# Altium project [G02]LinearFaderBoard.PrjPcb
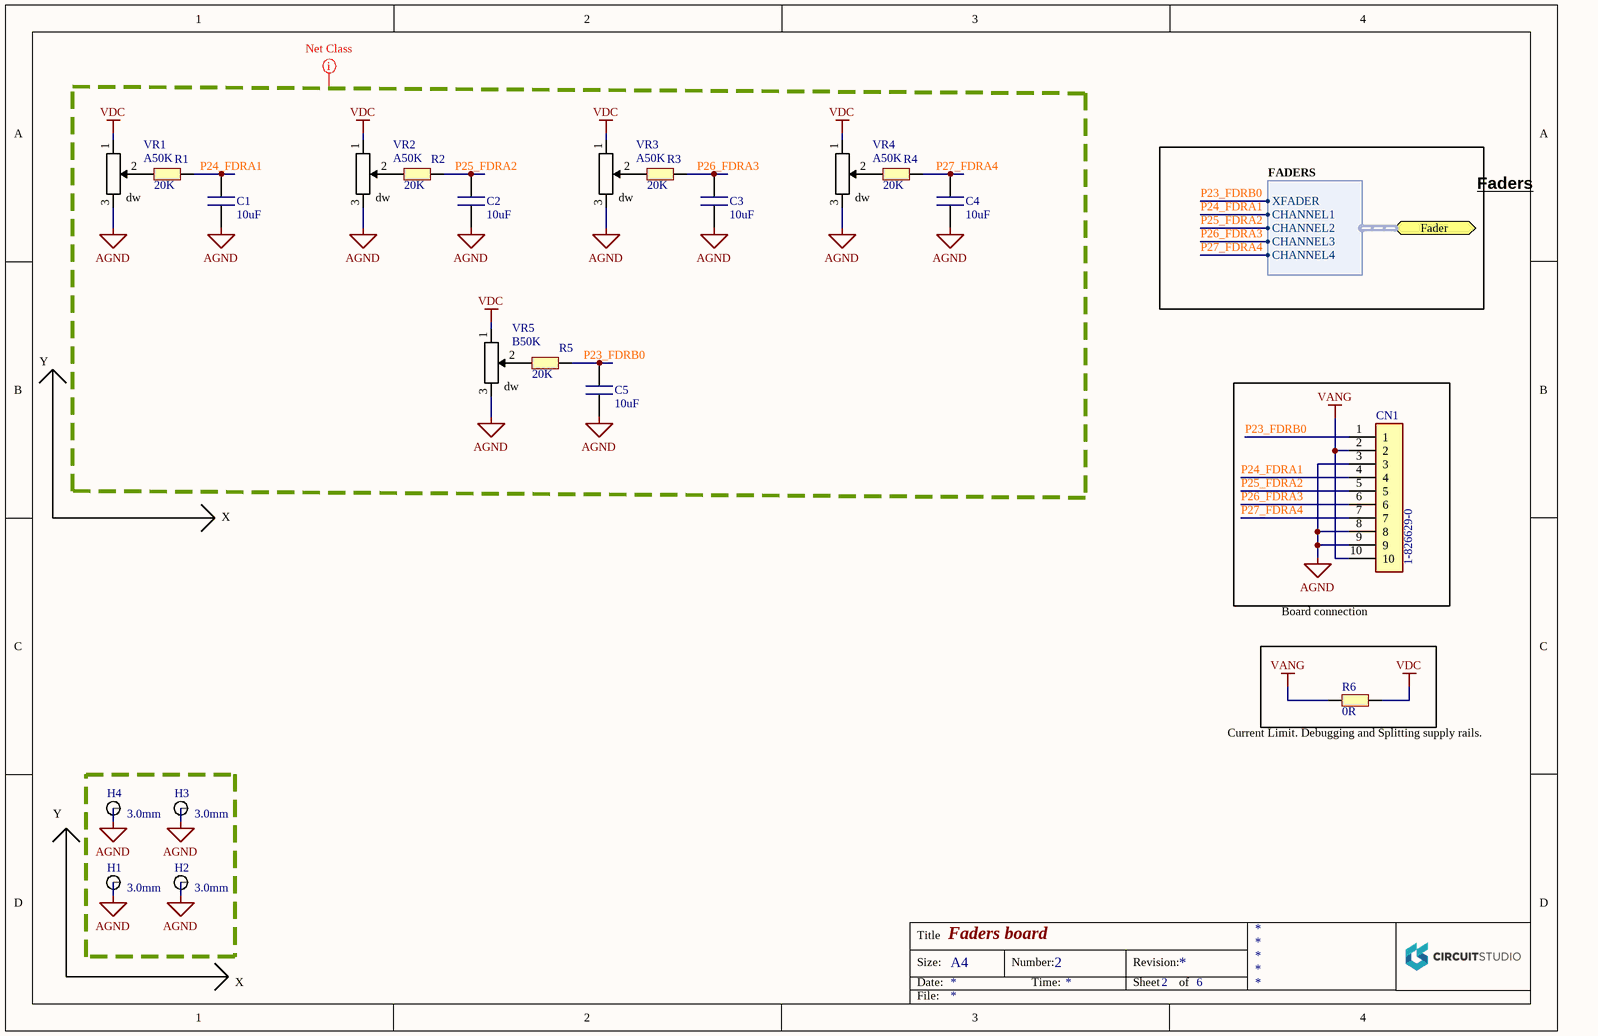
[diagram p0: LinearFaders.SchDoc]
Company: Adrengineer; DesignedByURL: Adrian; PartNumber: 0001; Project: 1
1 sheet, 21 parts. Net scope: global (net labels, ports and power ports of the same name join across sheets).

## Sheet LinearFaders.SchDoc: Faders board
size A4; CheckedBy: Manuel Raya; CompanyName: Universidad De Huelva; DrawnBy: Adrian Moreno; DocumentNumber: 2; SheetNumber: 2; SheetTotal: 6; PageSetup: Record=PageOptions|CenterHorizontal=True|CenterVertical=True|PrintScale=0.97|XCorrection=1.00|YCorrection=1.00|PrintKind=1|BorderSize=5000000|LeftOffset=0|BottomOffset=0|Orientation=2|PaperLength=1000|PaperWidth=1000|Scale=100|PaperSource=285|PrintQuality=-3|MediaType=1|DitherType=10|PrintScaleMode=1|PaperKind=A4|PaperIndex=9

### Parts
C1  10uF  [CAP 0603 10uF]
C2  10uF  [CAP 0603 10uF]
C3  10uF  [CAP 0603 10uF]
C4  10uF  [CAP 0603 10uF]
C5  10uF  [CAP 0603 10uF]
CN1  1-826629-0  [TE_1-826629-0]
H1  3.0mm  [HOLE-3.0MM+PAD]
H2  3.0mm  [HOLE-3.0MM+PAD]
H3  3.0mm  [HOLE-3.0MM+PAD]
H4  3.0mm  [HOLE-3.0MM+PAD]
R1  20K  [RES 0603 20K]
R2  20K  [RES 0603 20K]
R3  20K  [RES 0603 20K]
R4  20K  [RES 0603 20K]
R5  20K  [RES 0603 20K]
R6  0R  [RES 0603]
VR1  A50K  [PTA4543]
VR2  A50K  [PTA4543]
VR3  A50K  [PTA4543]
VR4  A50K  [PTA4543]
VR5  B50K  [PTA4543]

### Ports
Fader (harness FADERS)

### Harnesses
FADERS: XFADER, CHANNEL1, CHANNEL2, CHANNEL3, CHANNEL4

### Nets
AGND: C1.1 C2.1 C3.1 C4.1 C5.1 CN1.3 CN1.8 CN1.9 H1.1 H2.1 H3.1 H4.1 VR1.3 VR2.3 VR3.3 VR4.3 VR5.3
VANG: CN1.2 CN1.10 R6.1
VDC: R6.2 VR1.1 VR2.1 VR3.1 VR4.1 VR5.1
P23_FDRB0: C5.2 CN1.1 R5.2 ; port Fader.XFADER
P24_FDRA1: C1.2 CN1.4 R1.2 ; port Fader.CHANNEL1
P25_FDRA2: C2.2 CN1.5 R2.2 ; port Fader.CHANNEL2
P26_FDRA3: C3.2 CN1.6 R3.2 ; port Fader.CHANNEL3
P27_FDRA4: C4.2 CN1.7 R4.2 ; port Fader.CHANNEL4
NetR1_1: R1.1 VR1.2
NetR2_1: R2.1 VR2.2
NetR3_1: R3.1 VR3.2
NetR4_1: R4.1 VR4.2
NetR5_1: R5.1 VR5.2

### Layout directives
net class FdrGrp: (no net found under the mark)

### Notes on the sheet
- Faders
- Y
- X
- (near CN1) Board connection
- (near R6) Current Limit. Debugging and Splitting supply rails.
- Title
- Size:
- Date:
- A4
- Number:
- Time:
- Revision:
- Sheet
- of
- File:
- (in symbol PTA4543-2015CPA503) dw /
- (in symbol PTA4543-2015CPB503) dw /

### Library data of the parts
C1-C5 = CAP 0603 10uF: 16V 10uF X5R ±20% 0603 MLCC; MP: CS1608X5R106M160NRB; MN: Samwha Capacitor; Value: 10uF; Footprint: 0603; Tolerance: 20%; Dielectric: X5R; LCSC: C2909630
CN1 = 1-826629-0: Conn Unshrouded Header HDR 10 POS 2.54mm Solder ST Thru-Hole Carton; MF: TE Connectivity; Value: *; Availability: Unavailable; Price: None; Package: None; MP: 1-826629-0; SnapEDA_Link: https://www.snapeda.com/parts/1-826629-0/TE%20Connectivity%20AMP%20Connectors/view-part/2877207/?ref=snap
H1-H4 = 3.0MM HOLE+6mmPAD: Value: 3.0mm
R1-R5 = RES0603_20K: 0603 Standard 20K Resistor, 1%, 100mW, ±200ppm/℃,Thick Film; UA P/N: 13-0004; MP: ETCR0603F20K0K9; MN: Resistor.Today; Value: 20K; Footprint: 0603; Type: THICK FILM; LCSC: C365403; Price: *
R6 = RES0603_0R: 0603 Standard 0R Resistor, 1%, 100mW, ±200ppm/℃,Thick Film; UA P/N: 13-0004; MP: AF0603FR-070RL; MN: YAGEO; Value: 0R; Footprint: 0603; Type: THICK FILM; LCSC: C192909; Price: *
VR1-VR4 = PTA4543-2015CPA503: Slide Potentiometers PANEL CONTROL - SLIDE CARBON; MN: Bourns; MP: PTA4543-2015CPA503; Mouser: 652-PA45432015CPA503; LCSC: *; Price: £1.45; Value: A50K
VR5 = PTA4543-2015CPB503: Slide Potentiometers PANEL CONTROL - SLIDE CARBON; MN: Bourns; MP: PTA4543-2015CPB503; Mouser: 652-PA45532015CPB503; LCSC: *; Price: £1.39; Value: B50K